# Altium schematic sheet Altium_SHEET_STM8_DevBoard_2024-07-22.schdoc
size 416 x 295 mm
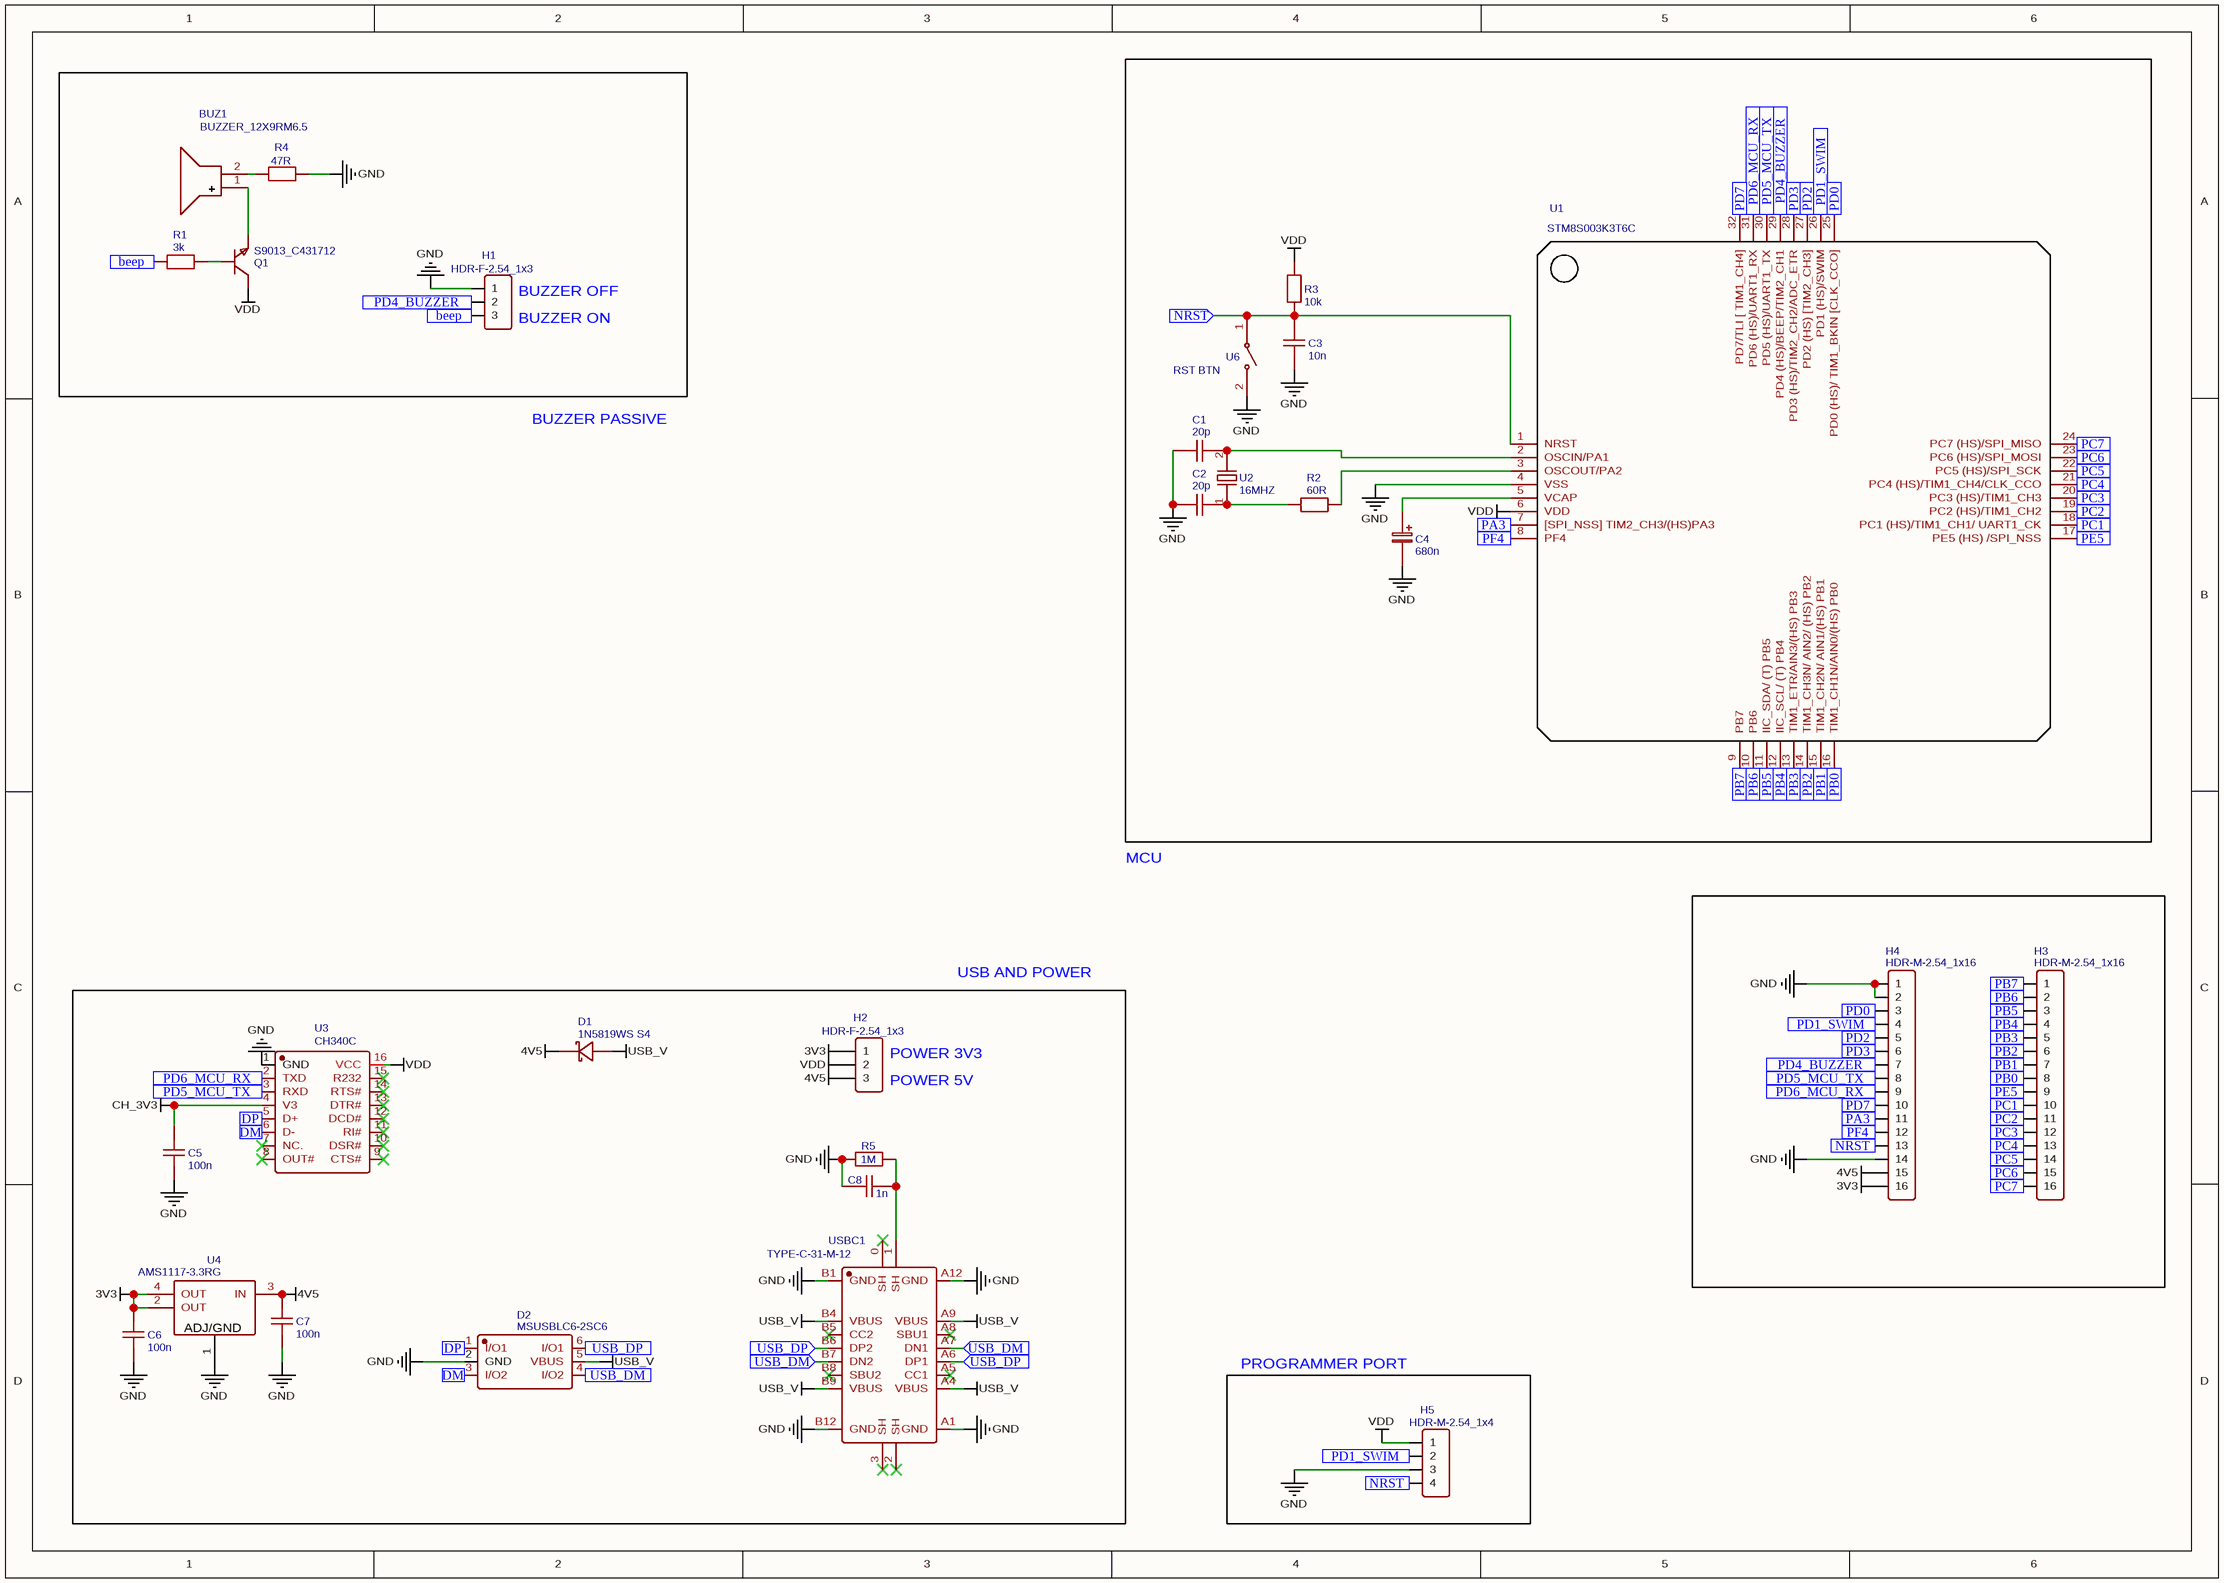
[diagram p0: Altium_SHEET_STM8_DevBoard_2024-07-22.schdoc]

## Parts
BUZ1  BUZZER_12X9RM6.5  [BUZ-TH_BD12.0-P6.50-D0.6_SEA-1285F]
C1  20p  [C0805]
C2  20p  [C0805]
C3  10n  [C0805]
C4  680n  [CASE-A_3216]
C5  100n  [C0805]
C6  100n  [C0805]
C7  100n  [C0805]
C8  1n  [C0805]
D1  1N5819WS S4  [SOD-323_L1.6-W1.3-LS2.7-RD]
D2  MSUSBLC6-2SC6  [SOT-23-6_L2.9-W1.6-P0.95-LS2.8-BL]
H1  HDR-F-2.54_1x3  [HDR-F-2.54_1X3]
H2  HDR-F-2.54_1x3  [HDR-F-2.54_1X3]
H3  HDR-M-2.54_1x16  [HDR-F-2.54_1X16]
H4  HDR-M-2.54_1x16  [HDR-F-2.54_1X16]
H5  HDR-M-2.54_1x4  [HDR-F-2.54_1X4]
Q1  S9013_C431712  [SOT-23_L2.9-W1.3-P1.90-LS2.4-BR]
R1  3k  [R0805]
R2  60R  [R0805]
R3  10k  [R0805]
R4  47R  [R0805]
R5  1M  [R0805]
U1  STM8S003K3T6C  [LQFP-32_L7.0-W7.0-P0.80-LS9.0-BL]
U2  16MHZ  [HC-49US_L11.0-W4.6-P4.88]
U3  CH340C  [SOP-16_L10.0-W3.9-P1.27-LS6.0-BL]
U4  AMS1117-3.3RG  [SOT-223-3_L6.4-W3.5-P2.30-LS7.0-BR]
U6  RST BTN  [SW-SMD_L3.9-W2.9-LS4.9-L]
USBC1  TYPE-C-31-M-12  [USB-C_SMD-TYPE-C-31-M-12]

## Blocks framed on the sheet
PROGRAMMER PORT: H5

## Ports
beep (in), DM (in), DP (in), NRST (in), PA3 (in), PB0 (in), PB1 (in), PB2 (in), PB3 (in), PB4 (in), PB5 (in), PB6 (in), PB7 (in), PC1 (in), PC2 (in), PC3 (in), PC4 (in), PC5 (in), PC6 (in), PC7 (in), PD0 (in), PD1_SWIM (in), PD2 (in), PD3 (in), PD4_BUZZER (in), PD5_MCU_TX (in), PD6_MCU_RX (in), PD7 (in), PE5 (in), PF4 (in), USB_DM (in), USB_DP (in)

## Nets
3V3: C6.2 H2.1 H4.16 U4.2(OUT) U4.4(OUT)
4V5: C7.2 D1.1(C) H2.3 H4.15 U4.3(IN)
CH_3V3: C5.2 U3.4(V3)
GND: C1.1 C2.1 C3.1 C4.2 C5.1 C6.1 C7.1 C8.2 D2.2(GND) H1.1 H4.1 H4.2 H4.14 H5.3 R4.1 R5.1 U1.4(VSS) U3.1(GND) U4.1(ADJ/GND) U6.2 USBC1.A1(GND) USBC1.A12(GND) USBC1.B1(GND) USBC1.B12(GND)
USB_V: D1.2(A) D2.5(VBUS) USBC1.A4(VBUS) USBC1.A9(VBUS) USBC1.B4(VBUS) USBC1.B9(VBUS)
VDD: H2.2 H5.1 Q1.3(C) R3.2 U1.6(VDD) U3.16(VCC)
beep: H1.3 R1.1 ; port beep
DM: D2.3(I/O2) U3.6(D-) ; port DM
DP: D2.1(I/O1) U3.5(D+) ; port DP
NRST: C3.2 H4.13 H5.4 R3.1 U1.1(NRST) U6.1 ; port NRST
PA3: H4.11 U1.7([SPI_NSS]_TIM2_CH3/(HS)PA3) ; port PA3
PB0: H3.8 U1.16(TIM1_CH1N/AIN0/(HS)_PB0) ; port PB0
PB1: H3.7 U1.15(TIM1_CH2N/_AIN1/(HS)_PB1) ; port PB1
PB2: H3.6 U1.14(TIM1_CH3N/_AIN2/_(HS)_PB2) ; port PB2
PB3: H3.5 U1.13(TIM1_ETR/AIN3/(HS)_PB3) ; port PB3
PB4: H3.4 U1.12(IIC_SCL/_(T)_PB4) ; port PB4
PB5: H3.3 U1.11(IIC_SDA/_(T)_PB5) ; port PB5
PB6: H3.2 U1.10(PB6) ; port PB6
PB7: H3.1 U1.9(PB7) ; port PB7
PC1: H3.10 U1.18(PC1_(HS)/TIM1_CH1/_UART1_CK) ; port PC1
PC2: H3.11 U1.19(PC2_(HS)/TIM1_CH2) ; port PC2
PC3: H3.12 U1.20(PC3_(HS)/TIM1_CH3) ; port PC3
PC4: H3.13 U1.21(PC4_(HS)/TIM1_CH4/CLK_CCO) ; port PC4
PC5: H3.14 U1.22(PC5_(HS)/SPI_SCK) ; port PC5
PC6: H3.15 U1.23(PC6_(HS)/SPI_MOSI) ; port PC6
PC7: H3.16 U1.24(PC7_(HS)/SPI_MISO) ; port PC7
PD0: H4.3 U1.25(PD0_(HS)/_TIM1_BKIN_[CLK_CCO]) ; port PD0
PD1_SWIM: H4.4 H5.2 U1.26(PD1_(HS)/SWIM) ; port PD1_SWIM
PD2: H4.5 U1.27(PD2_(HS)_[TIM2_CH3]) ; port PD2
PD3: H4.6 U1.28(PD3_(HS)/TIM2_CH2/ADC_ETR) ; port PD3
PD4_BUZZER: H1.2 H4.7 U1.29(PD4_(HS)/BEEP/TIM2_CH1) ; port PD4_BUZZER
PD5_MCU_TX: H4.8 U1.30(PD5_(HS)/UART1_TX) U3.3(RXD) ; port PD5_MCU_TX
PD6_MCU_RX: H4.9 U1.31(PD6_(HS)/UART1_RX) U3.2(TXD) ; port PD6_MCU_RX
PD7: H4.10 U1.32(PD7/TLI_[_TIM1_CH4]) ; port PD7
PE5: H3.9 U1.17(PE5_(HS)_/SPI_NSS) ; port PE5
PF4: H4.12 U1.8(PF4) ; port PF4
USB_DM: D2.4(I/O2) USBC1.A7(DN1) USBC1.B7(DN2) ; port USB_DM
USB_DP: D2.6(I/O1) USBC1.A6(DP1) USBC1.B6(DP2) ; port USB_DP
NetBUZ1_1: BUZ1.1(+) Q1.2(E)
NetBUZ1_2: BUZ1.2(-) R4.2
NetC1_2: C1.2 U1.2(OSCIN/PA1) U2.2
NetC2_2: C2.2 R2.1 U2.1
NetC4_1: C4.1 U1.5(VCAP)
NetC8_1: C8.1 R5.2 USBC1.1(SH)
NetQ1_1: Q1.1(B) R1.2
NetR2_2: R2.2 U1.3(OSCOUT/PA2)

Not connected (* = marked no-connect by the designer): U3 7(NC.)* 8(OUT#)* 9(CTS#)* 10(DSR#)* 11(RI#)* 12(DCD#)* 13(DTR#)* 14(RTS#)* 15(R232)*; USBC1 0(SH)* 2(SH)* 3(SH)* A5(CC1)* A8(SBU1)* B5(CC2)* B8(SBU2)*

## Notes on the sheet
- (near H1) BUZZER OFF
- (near H1) BUZZER ON
- BUZZER PASSIVE
- MCU
- USB AND POWER
- (near H2) POWER 3V3
- (near H2) POWER 5V

## Library data of the parts
BUZ1 = BUZZER_12X9RM6.5: Manufacturer: null; Manufacturer Part: chenzj1:Buzzer_12x9.5RM6.5; Contributor: LCSC; Supplier: LCSC; Supplier Part: C9900008742; JLCPCB Part Class: Extended Part; spicePre: B; spiceSymbolName: CHENZJ1:BUZZER_12X9.5RM6.5
C1 C2 = 20p: nameAlias: Value(F); Contributor: LCEDA_Lib; spicePre: C; spiceSymbolName: C_0805_US
C3 = 10n: nameAlias: Value(F); Contributor: LCEDA_Lib; spicePre: C; spiceSymbolName: C_0805_US
C4 = 680n: nameAlias: Value(F); Contributor: LCEDA_Lib; spicePre: C; spiceSymbolName: C_Tan_SMD_A_EU
C5-C7 = 100n: nameAlias: Value(F); Contributor: LCEDA_Lib; spicePre: C; spiceSymbolName: C_0805_US
C8 = 1n: nameAlias: Value(F); Contributor: LCEDA_Lib; spicePre: C; spiceSymbolName: C_0805_US
D1 = 1N5819WS S4: Manufacturer: JSMSEMI(杰盛微); Contributor: LCSC; Supplier: LCSC; Supplier Part: C2927280; Manufacturer Part: 1N5819WS S4; JLCPCB Part Class: Extended Part; spicePre: D; spiceSymbolName: 1N5819WS S4
D2 = MSUSBLC6-2SC6: Manufacturer: MSKSEMI(美森科); Contributor: lcsc; Supplier: LCSC; Supplier Part: C2830148; Manufacturer Part: MSUSBLC6-2SC6; JLCPCB Part Class: Extended Part; spicePre: D; spiceSymbolName: MSUSBLC6-2SC6
H1 H2 = HDR-F-2.54_1x3: Contributor: LCEDA_Lib; Supplier Part: C146690; Supplier: LCSC; spicePre: H; spiceSymbolName: HDR-F-2.54_1x3
H3 H4 = HDR-M-2.54_1x16: Contributor: LCEDA_Lib; Supplier Part: C66987; Supplier: LCSC; spicePre: H; spiceSymbolName: HDR-F-2.54_1x16
H5 = HDR-M-2.54_1x4: Contributor: LCEDA_Lib; Supplier Part: C225501; Supplier: LCSC; spicePre: H; spiceSymbolName: HDR-F-2.54_1x4
Q1 = S9013_C431712: Manufacturer: MDD(辰达半导体); Manufacturer Part: S9013; Contributor: LCSC; Supplier: LCSC; Supplier Part: C431712; JLCPCB Part Class: Extended Part; spicePre: Q; spiceSymbolName: S9013_C431712
R1 = 3k: nameAlias: Value(Ω); Contributor: LCEDA_Lib; spicePre: R; spiceSymbolName: R_0805_EU
R2 = 60R: nameAlias: Value(Ω); Contributor: LCEDA_Lib; spicePre: R; spiceSymbolName: R_0805_EU
R3 = 10k: nameAlias: Value(Ω); Contributor: LCEDA_Lib; spicePre: R; spiceSymbolName: R_0805_EU
R4 = 47R: nameAlias: Value(Ω); Contributor: LCEDA_Lib; spicePre: R; spiceSymbolName: R_0805_EU
R5 = 1M: nameAlias: Value(Ω); Contributor: LCEDA_Lib; spicePre: R; spiceSymbolName: R_0805_EU
U1 = STM8S003K3T6C: Manufacturer: ST(意法半导体); Supplier: LCSC; Manufacturer Part: STM8S003K3T6C; Supplier Part: C27142; JLCPCB Part Class: Extended Part; spicePre: U; spiceSymbolName: STM8S003K3T6C
U2 = 16MHZ: Manufacturer: null; Contributor: lcsc; Supplier: LCSC; Supplier Part: C9900024699; Manufacturer Part: 16MHZ; JLCPCB Part Class: Extended Part; spicePre: U; spiceSymbolName: 16MHZ_C9900024699
U3 = CH340C: Manufacturer: WCH(南京沁恒); Supplier: LCSC; Manufacturer Part: CH340C; Supplier Part: C84681; JLCPCB Part Class: Extended Part; spicePre: U; spiceSymbolName: CH340C
U4 = AMS1117-3.3RG: Manufacturer: HGC(深圳汉芯); Contributor: lcsc; Supplier: LCSC; Supplier Part: C2977152; Manufacturer Part: AMS1117-3.3RG; JLCPCB Part Class: Extended Part; spicePre: U; spiceSymbolName: AMS1117-3.3RG
U6 = RST BTN: Manufacturer: null; Manufacturer Part: BUTTON; Contributor: lcsc; Supplier: LCSC; Supplier Part: C9900015607; JLCPCB Part Class: Extended Part; spicePre: U; spiceSymbolName: BUTTON
USBC1 = TYPE-C-31-M-12: Manufacturer: 韩国韩荣; Contributor: LCSC; Supplier: LCSC; Supplier Part: C165948; Manufacturer Part: TYPE-C-31-M-12; JLCPCB Part Class: Extended Part; spicePre: U; spiceSymbolName: TYPE-C-31-M-12